# Altium schematic sheet Discharge_Load_Switch.SchDoc
size A4; Organization: TESLA Motors, INC; Address1: 3500 Deer Creek Road; Address2: Palo Alto, CA; Address4: U.S.A.; SheetNumber: 7; SheetTotal: 8
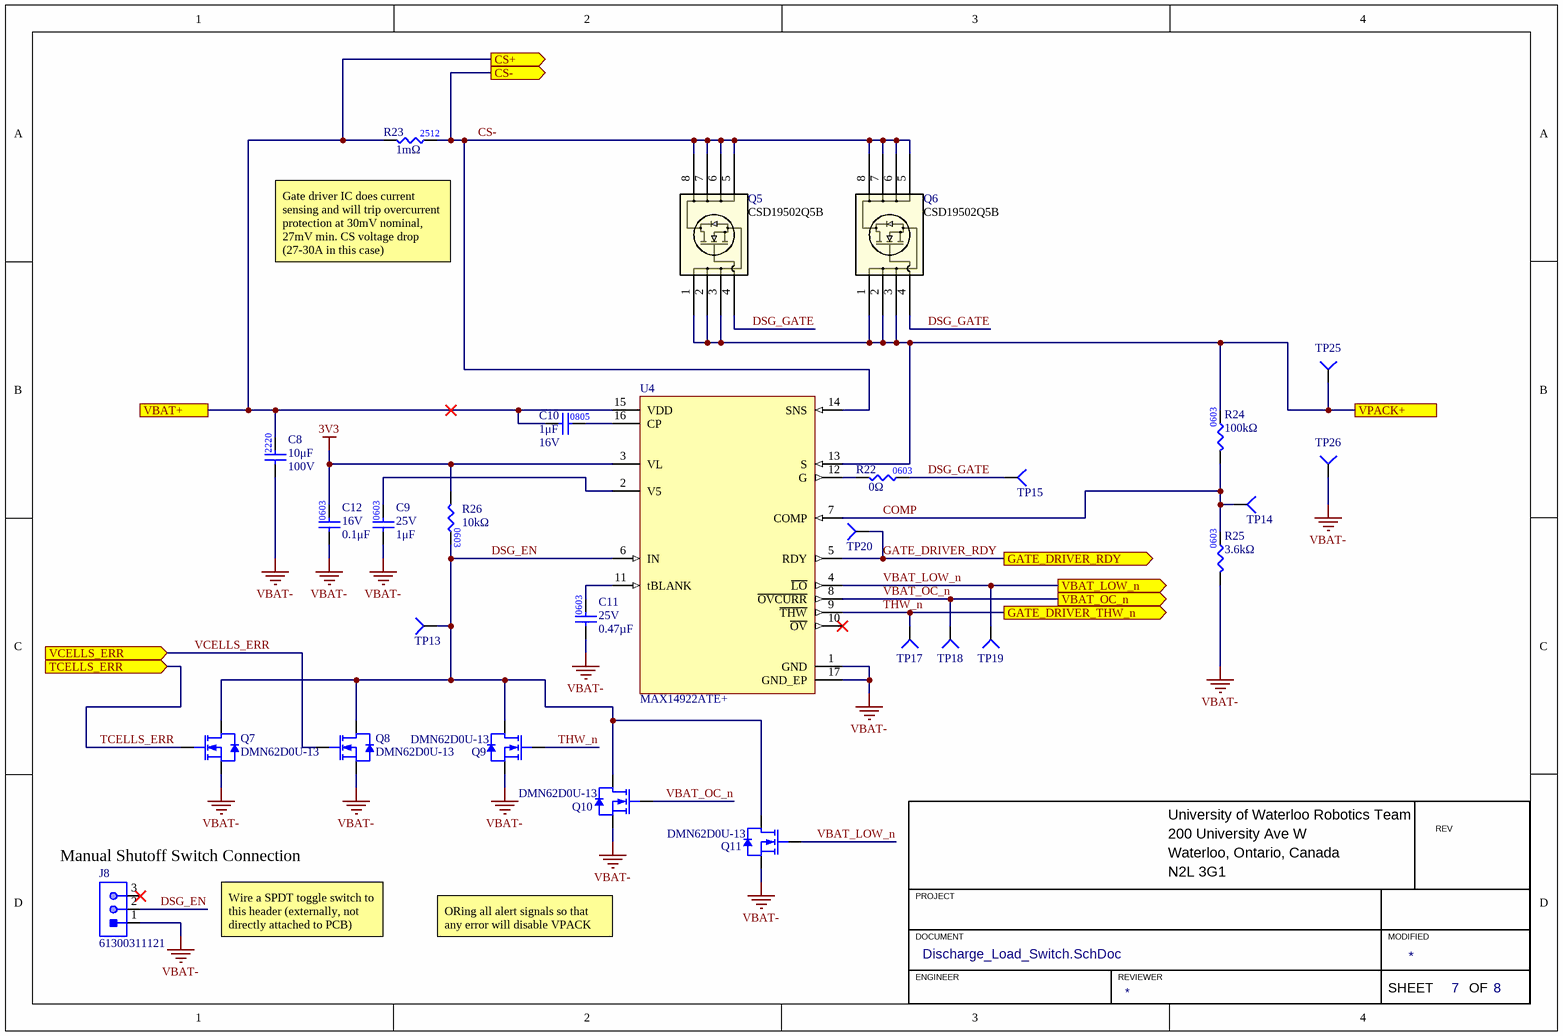
[diagram p0: Discharge_Load_Switch.SchDoc]

## Parts
C8  value 10μF  Voltage Rating: 100V  [CAP2220]  (hidden comment: CAP_10μF_100V_2220)
C9  value 1μF  Voltage Rating: 25V  [CAP0603]  (hidden comment: CAP_1uF_25V_0603)
C10  value 1μF  Voltage Rating: 16V  [CAP0805]  (hidden comment: CAP_1uF_16V_0805)
C11  value 0.47µF  Voltage Rating: 25V  [CAP0603]  (hidden comment: CAP_0.47uF_25V_0603)
C12  value 0.1μF  Voltage Rating: 16V  [CAP0603]  (hidden comment: CAP_0.1uF_16V_0603)
J8  Manufacturer Part Number 1: 61300311121  [HDR1X3]  (hidden comment: HEADER 3x1)
Q5  CSD19502Q5B  [DFN5060]
Q6  CSD19502Q5B  [DFN5060]
Q7  Manufacturer Part Number 1: DMN62D0U-13  [NMOS_SSOT-3]  (hidden comment: NMOS_60V_380mA)
Q8  Manufacturer Part Number 1: DMN62D0U-13  [NMOS_SSOT-3]  (hidden comment: NMOS_60V_380mA)
Q9  Manufacturer Part Number 1: DMN62D0U-13  [NMOS_SSOT-3]  (hidden comment: NMOS_60V_380mA)
Q10  Manufacturer Part Number 1: DMN62D0U-13  [NMOS_SSOT-3]  (hidden comment: NMOS_60V_380mA)
Q11  Manufacturer Part Number 1: DMN62D0U-13  [NMOS_SSOT-3]  (hidden comment: NMOS_60V_380mA)
R22  value 0Ω  [RES0603]  (hidden comment: RES_0Ω_0603)
R23  value 1mΩ  [RESC6532X75N]  (hidden comment: RES_1mΩ_2512_1%)
R24  value 100kΩ  [RES0603]  (hidden comment: RES_100kΩ_0603_1%)
R25  value 3.6kΩ  [RES0603]  (hidden comment: RES_3.6kΩ_0603_1%)
R26  value 10kΩ  [RES0603]  (hidden comment: RES_10kΩ_0603_1%)
TP13  TESTPOINT_1MM_CIRCLE  [TESTPOINT_CIRCLE_1MM]  (value not drawn)  (no BOM)
TP14  TESTPOINT_1MM_CIRCLE  [TESTPOINT_CIRCLE_1MM]  (value not drawn)  (no BOM)
TP15  TESTPOINT_1MM_CIRCLE  [TESTPOINT_CIRCLE_1MM]  (value not drawn)  (no BOM)
TP17  TESTPOINT_1MM_CIRCLE  [TESTPOINT_CIRCLE_1MM]  (value not drawn)  (no BOM)
TP18  TESTPOINT_1MM_CIRCLE  [TESTPOINT_CIRCLE_1MM]  (value not drawn)  (no BOM)
TP19  TESTPOINT_1MM_CIRCLE  [TESTPOINT_CIRCLE_1MM]  (value not drawn)  (no BOM)
TP20  TESTPOINT_1MM_CIRCLE  [TESTPOINT_CIRCLE_1MM]  (value not drawn)  (no BOM)
TP25  TESTPOINT_SMD_LOOP  [S1751-46R]  (value not drawn)
TP26  TESTPOINT_SMD_LOOP  [S1751-46R]  (value not drawn)
U4  MAX14922ATE+  [16-WFQFN MAXIM]

## Ports
CS+ (out), CS- (out), GATE_DRIVER_RDY (out), GATE_DRIVER_THW_n (out), TCELLS_ERR (in), VBAT+, VBAT_LOW_n (out), VBAT_OC_n (out), VCELLS_ERR (in), VPACK+

## Nets
3V3: C12.2 R26.1 U4.3(VL)
VBAT-: C8.1 C9.1 C11.1 C12.1 J8.1 Q7.2(SOURCE) Q8.2(SOURCE) Q9.2(SOURCE) Q10.2(SOURCE) Q11.2(SOURCE) R25.1 TP26.1(=value) U4.1(GND) U4.17(GND_EP)
COMP: R24.1 R25.2 TP14.1(=value) U4.7(COMP)
CS+: C8.2 C10.1 R23.1 U4.15(VDD) ; port VBAT+, port CS+
CS-: Q5.5(D) Q5.6(D) Q5.7(D) Q5.8(D) Q6.5(D) Q6.6(D) Q6.7(D) Q6.8(D) R23.2 U4.14(SNS) ; port CS-
DSG_EN: J8.2 Q7.3(DRAIN) Q8.3(DRAIN) Q9.3(DRAIN) Q10.3(DRAIN) Q11.3(DRAIN) R26.2 TP13.1(=value) U4.6(IN)
DSG_GATE: Q5.4(G) Q6.4(G) R22.2 TP15.1(=value)
GATE_DRIVER_RDY: TP20.1(=value) U4.5(RDY) ; port GATE_DRIVER_RDY
TCELLS_ERR: Q7.1(GATE) ; port TCELLS_ERR
THW_n: Q9.1(GATE) TP17.1(=value) U4.9(~{THW}) ; port GATE_DRIVER_THW_n
VBAT_LOW_n: Q11.1(GATE) TP19.1(=value) U4.4(~{LO}) ; port VBAT_LOW_n
VBAT_OC_n: Q10.1(GATE) TP18.1(=value) U4.8(~{OVCURR}) ; port VBAT_OC_n
VCELLS_ERR: Q8.1(GATE) ; port VCELLS_ERR
VPACK+: Q5.1(S) Q5.2(S) Q5.3(S) Q6.1(S) Q6.2(S) Q6.3(S) R24.2 TP25.1(=value) U4.13(S) ; port VPACK+
NetC9_2: C9.2 U4.2(V5)
NetC10_2: C10.2 U4.16(CP)
NetC11_2: C11.2 U4.11(tBLANK)
NetR22_1: R22.1 U4.12(G)

Not connected (* = marked no-connect by the designer): J8 3*; U4 10(~{OV})*

## Notes on the sheet
- (near R23) Gate driver IC does current sensing and will trip overcurrent protection at 30mV nominal, 27mV min. CS voltage drop (27-30A in this case)
- (near J8) Manual Shutoff Switch Connection
- University of Waterloo Robotics Team
- 200 University Ave W
- REV
- PROJECT
- Waterloo, Ontario, Canada
- N2L 3G1
- Wire a SPDT toggle switch to this header (externally, not directly attached to PCB)
- ORing all alert signals so that any error will disable VPACK
- DOCUMENT
- ENGINEER
- REVIEWER
- MODIFIED
- SHEET
- OF
- (in symbol RES_100kΩ_0603_1%) 0603

## Library data of the parts
C8 = CAP_10μF_100V_2220: CAP CER 10UF 100V X7S 2220; Manufacturer 1: TDK Corporation; Manufacturer Part Number 1: CGA9N3X7S2A106K230KE; Mounting Type: SMD; Package: 2220; Supplier 1: Digi-Key; Supplier Part Number 1: 445-8768-1-ND
C9 = CAP_1uF_25V_0603: CAP CER 1UF 25V X5R 0603; Manufacturer 1: Samsung; Manufacturer Part Number 1: CL10A105KA8NNNC; Supplier 1: Digi-Key; Mounting Type: SMD; Package: 0603; Supplier Part Number 1: 1276-1102-1-ND; Dielectric: X5R
C10 = CAP_1uF_16V_0805: CAP CER 1UF 16V X7R 0805; Manufacturer 1: Yageo; Manufacturer Part Number 1: CC0805KKX7R7BB105; Mounting Type: SMD; Supplier 1: Digi-Key; Supplier Part Number 1: 311-1365-1-ND; Package: 0805; Dielectric: X7R
C11 = CAP_0.47uF_25V_0603: CAP CER 0.47UF 25V X7R 0603; Manufacturer 1: KEMET; Manufacturer Part Number 1: C0603C474K3RAC7867; Package: 0603; Supplier 1: Digi-Key; Supplier Part Number 1: 399-11934-1-ND
C12 = CAP_0.1uF_16V_0603: CAP CER 0.1UF 16V X7R 0603; Manufacturer Part Number 1: CC0603KRX7R7BB104; Manufacturer 1: Yageo; Package: 0603; Supplier Part Number 1: 311-1088-1-ND; Supplier 1: Digi-Key; Dielectric: X7R
J8 = HEADER 3x1: CONN HEADER VERT 3POS 2.54MM; Manufacturer 1: Würth Elektronik; Supplier 1: Digi-Key; Mounting Type: TH; Pitch: 2.54mm; Supplier Part Number 1: 732-5316-ND
Q5 Q6 = NMOS_CSD19502Q5B_80V_100A: MOSFET N-CH 80V 100A 8VSON; Manufacturer 1: Texas Instruments; Vgs (Max): ±20V; Package/Footprint: 8-PowerTDFN; Vdss (Max): 80V; Id: 100A; Supplier 1: Digi-Key; Supplier Part Number 1: 296-37194-1-ND; Manufacturer Part Number 1: CSD19502Q5B
Q7-Q11 = NMOS_60V_380mA: MOSFET N-CH 60V 380MA SOT23; Manufacturer 1: Diodes Incorporated; Vgs (Max): ±12V; Supplier 1: Digi-Key; Mounting Type: SMD; Package: SOT-23-3; Supplier Part Number 1: DMN62D0U-13DICT-ND; Id: 380mA; Vdss: 60V
R22 = RES_0Ω_0603: RES 0 OHM JUMPER 1/10W 0603; Manufacturer 1: Yageo; Manufacturer Part Number 1: RC0603JR-070RL; Supplier Part Number 1: 311-0.0GRCT-ND; Supplier 1: Digi-Key; Mounting Type: SMD; Package: 0603
R23 = RES_1mΩ_2512_1%: RES 1 mOHM 1% 3W 2512; Manufacturer 1: Riedon; Manufacturer Part Number 1: CSRL3-0R001F8; Supplier 1: Digi-Key; Supplier Part Number 1: 696-1834-1-ND; Mounting Type: SMD; Package: 2512
R24 = RES_100kΩ_0603_1%: RES 100K OHM 1% 1/10W 0603; Manufacturer 1: Yageo; Manufacturer Part Number 1: RC0603FR-07100KL; Supplier Part Number 1: 311-100KHRCT-ND; Supplier 1: Digi-Key
R25 = RES_3.6kΩ_0603_1%: RES 3.6K OHM 1% 1/10W 0603; Manufacturer 1: Yageo; Manufacturer Part Number 1: RC0603FR-073K6L; Mounting Type: SMD; Package: 0603; Supplier 1: Digi-Key; Supplier Part Number 1: 311-3.60KHRCT-ND
R26 = RES_10kΩ_0603_1%: RES 10K OHM 1% 1/8W 0603; Manufacturer 1: Stackpole Electronics Inc; Manufacturer Part Number 1: RNCP0603FTD10K0; Supplier Part Number 1: RNCP0603FTD10K0CT-ND; Supplier 1: Digi-Key; Mounting Type: SMD; Package: 0603
TP13-TP15 TP17-TP20 = TESTPOINT_1MM_CIRCLE: TESTPOINT 1MM CIRCLE
TP25 TP26 = TESTPOINT_SMD_LOOP: TESTPOINT SMD LOOP; Manufacturer 1: Harwin; Supplier 1: Digi-Key; Manufacturer Part Number 1: S1751-46R; Mounting Type: SMD; Package/Footprint: SMD; Supplier Part Number 1: 952-1478-1-ND
U4 = MAX14922ATE+: HIGH-SIDE SWITCH CONTROLLER; Manufacturer 1: Analog Devices Inc./Maxim Integrated; Package/Footprint: 16-WFQFN; Manufacturer Part Number 1: MAX14922ATE+; Supplier 1: Mouser; Supplier Part Number 1: 700-MAX14922ATE+T